# EAGLE board udayworks60 (EAGLE 9.6.2), part 1 of 2
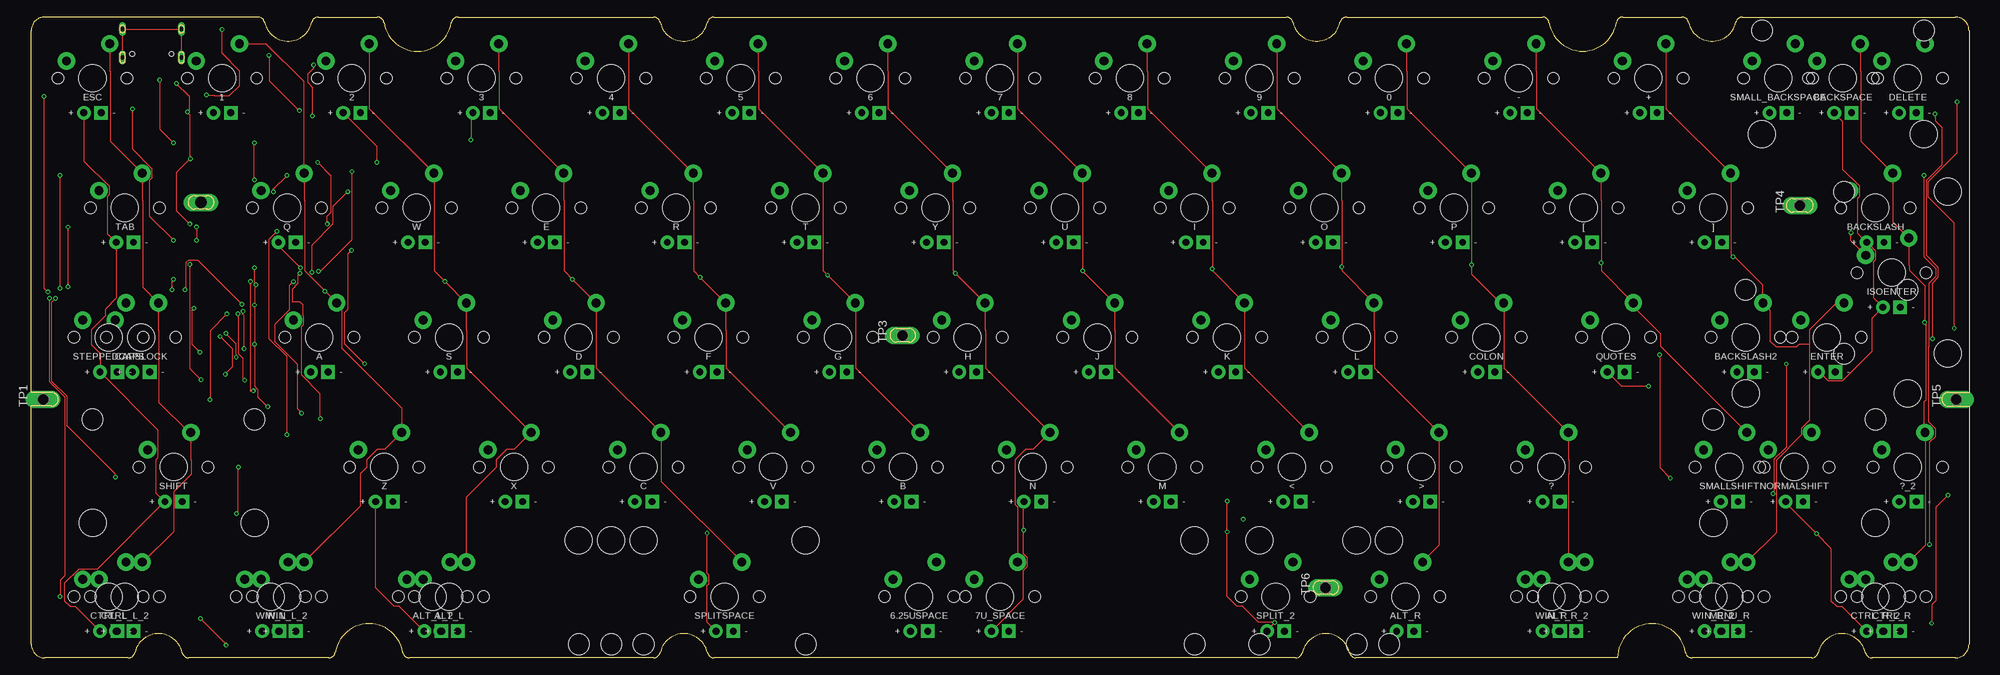
[diagram p5: board, top side]
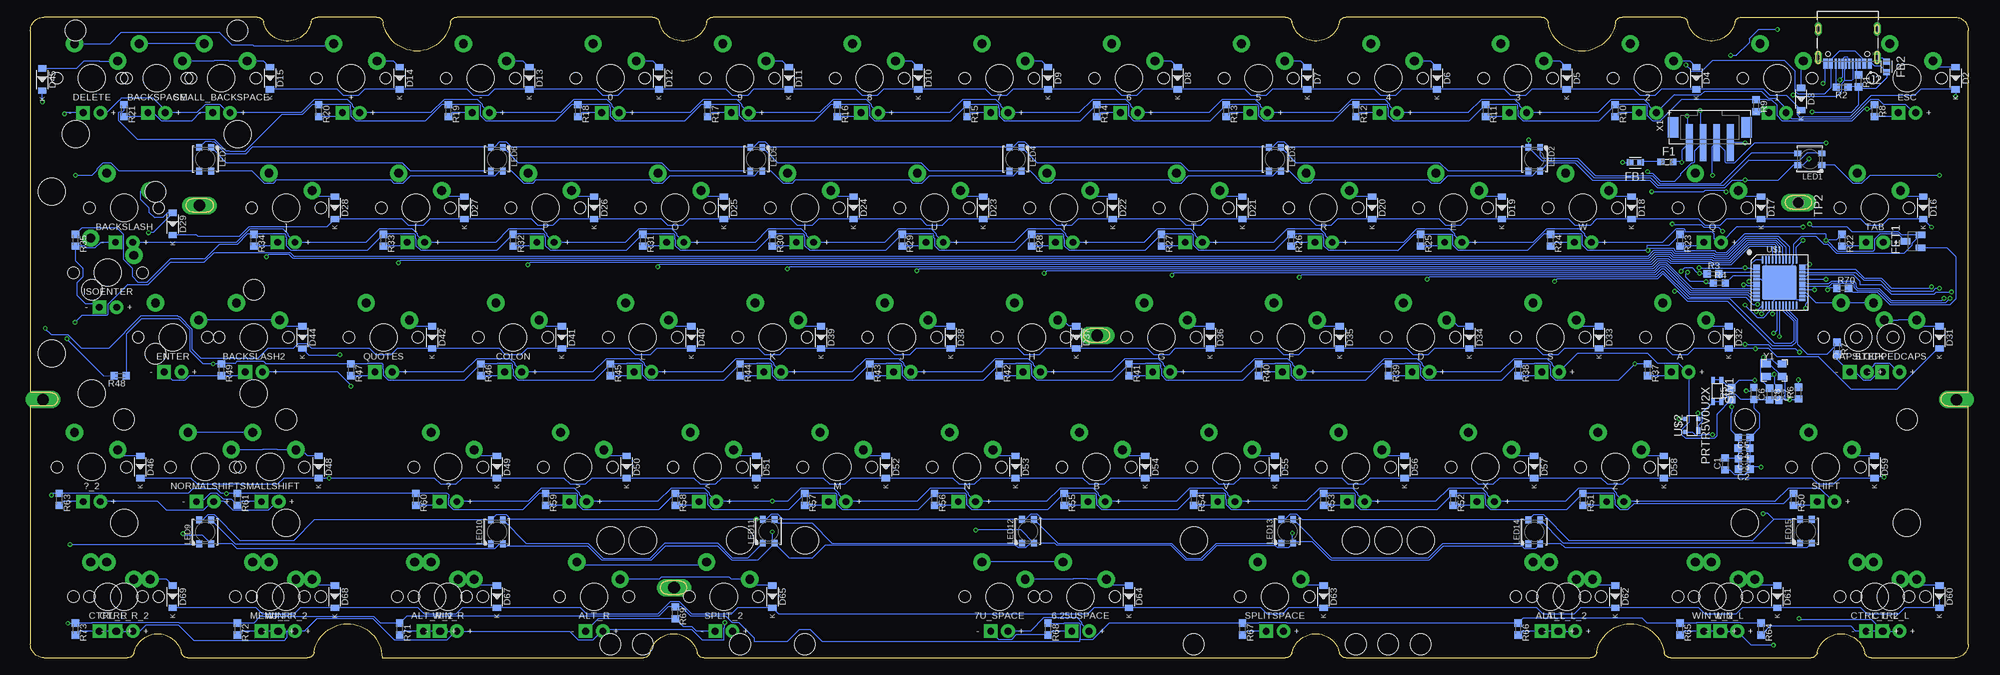
[diagram p6: board, bottom side, seen from below]

Size 284.7 x 94.2 mm. Coordinates in mm from the lower left corner, seen from the top.
Outline: 284.7,39 284.7,92.2 arc90 282.7,94.2 251.41,94.2 arc77 250.43,93.42 arc-155 243.49,93.42 arc77 242.52,94.2 233.87,94.2 arc80 232.88,93.37 arc-161 222.99,93.37 arc80 222,94.2 193.28,94.2 arc77 192.31,93.42 arc-155 185.37,93.42 arc77 184.39,94.2 100.32,94.2 arc77 99.34,93.42 arc-155 92.41,93.42 arc77 91.43,94.2 62.71,94.2 arc80 61.72,93.37 arc-161 51.83,93.37 arc80 50.84,94.2 42.2,94.2 arc77 41.22,93.42 arc-155 34.28,93.42 arc77 33.31,94.2 2,94.2 arc90 0,92.2 0,39
Outline: 0,37 0,2 arc90 2,0 14.26,0 arc77 15.23,0.78 arc-155 22.17,0.78 arc77 23.15,0 43.7,0 arc80 44.68,0.83 arc-161 54.58,0.83 arc80 55.57,0 91.43,0 arc77 92.41,0.78 arc-155 99.34,0.78 arc77 100.32,0 185.77,0 arc77 186.74,0.78 arc-155 193.68,0.78 arc77 194.66,0 233.06,0 arc-170 243.03,0.83 arc80 244.02,0 261.57,0 arc77 262.54,0.78 arc-155 269.48,0.78 arc77 270.46,0 282.7,0 arc90 284.7,2 284.7,37
Copper layers (1*16): Top 0.035mm / dielectric 1.5mm / Bottom 0.035mm
Design rules "default *": minimum track width 6mil, minimum drill 0.35mm, track to track 6mil, track to pad 6mil, pad to pad 6mil, via to via 6mil, smd to smd 6mil, copper to edge 20mil, drill to drill 6mil, minimum pad ring 6mil, minimum via ring 6mil, stop-mask expansion 4mil, vias tented up to drill 0mil, thermal gap 10mil
Milling: 22 lines

## Footprints (pad centres in the part's own frame; a part is rotated, then mirrored left to right if it is on the bottom)
MX-1U-LED = drill 1 pad 2: LED+ -1.27,-5.08 | drill 1 pad 2 square: LED- 1.27,-5.08 | drill 1.3 pad 2.54: MX1 -3.81,2.54; MX2 2.54,5.08 | hole 4: 0,0 | hole 1.7: -5.08,0; 5.08,0
MX-6.25U-LED-FLIPPED = drill 1 pad 2: LED+ -1.27,-5.08 | drill 1 pad 2 square: LED- 1.27,-5.08 | drill 1.3 pad 2.54: MX1 -3.81,2.54; MX2 2.54,5.08 | hole 4: 0,0; -50,8.24; 50,8.24 | hole 1.7: -5.08,0; 5.08,0 | hole 3.05: -50,-7; 50,-7
MX-7U-LED-FLIPPED = drill 1 pad 2: LED+ -1.27,-5.08 | drill 1 pad 2 square: LED- 1.27,-5.08 | drill 1.3 pad 2.54: MX1 -3.81,2.54; MX2 2.54,5.08 | hole 4: 0,0; -57.15,8.24; 57.15,8.24 | hole 1.7: -5.08,0; 5.08,0 | hole 3.05: -57.15,-7; 57.15,-7
MX-2U-LED = drill 1 pad 2: LED+ -1.27,-5.08 | drill 1 pad 2 square: LED- 1.27,-5.08 | drill 1.3 pad 2.54: MX1 -3.81,2.54; MX2 2.54,5.08 | hole 4: 0,0; -11.9,-8.24; 11.9,-8.24 | hole 1.7: -5.08,0; 5.08,0 | hole 3.05: -11.9,7; 11.9,7
C0603 = smd 1.05 x 1.08: 1 -0.875,0; 2 0.875,0
SOD-123 = smd 0.91 x 1.22: A -1.635,0; C 1.635,0
0603L = smd 1 x 1: 1 -0.9,0; 2 0.9,0
BEADC1608X95N = smd 0.9 x 0.97: 1 -0.785,0 | smd 0.933 x 0.97: 2 0.769,0
SOT-23-3 = smd 1 x 1.4: 1 -0.95,-1.1; 2 0.95,-1.1; 3 0,1.1
MX-2U-LED-FLIPPED-ROTATED = drill 1 pad 2: LED+ -1.27,-5.08 | drill 1 pad 2 square: LED- 1.27,-5.08 | drill 1.3 pad 2.54: MX1 -3.81,2.54; MX2 2.54,5.08 | hole 4: 0,0; 8.24,-11.9; 8.24,11.9 | hole 1.7: -5.08,0; 5.08,0 | hole 3.05: -7,-11.9; -7,11.9
HRO_TYPE-C-31-M-12 = smd 0.6 x 1.45: A1B12 -3.25,5.095; A4B9 -2.45,5.095; B1A12 3.25,5.095; B4A9 2.45,5.095 | smd 0.3 x 1.45: A5 -1.25,5.095; A6 -0.25,5.095; A7 0.25,5.095; A8 1.25,5.095; B5 1.75,5.095; B6 0.75,5.095; B7 -0.75,5.095; B8 -1.75,5.095 | drill 0.65 pad 1.05 long: S1 -4.32,4.18; S2 4.32,4.18; S3 -4.32,0; S4 4.32,0 | hole 0.7: -2.89,3.65; 2.89,3.65
LED3535 = smd 1 x 0.85: 1 -1.75,0.875; 2 -1.75,-0.875; 3 1.75,-0.875; 4 1.75,0.875
R0603 = smd 1.05 x 1.08: 1 -0.875,0; 2 0.875,0
MX-2U-LED-FLIPPED = drill 1 pad 2: LED+ -1.27,-5.08 | drill 1 pad 2 square: LED- 1.27,-5.08 | drill 1.3 pad 2.54: MX1 -3.81,2.54; MX2 2.54,5.08 | hole 4: 0,0; -11.9,8.24; 11.9,8.24 | hole 1.7: -5.08,0; 5.08,0 | hole 3.05: -11.9,-7; 11.9,-7
SWITCH-SMD-EVP-BB2A9B00 = smd 0.95 x 0.55: A@1 -1.6,0.6; A@2 -1.6,-0.6; B@3 1.6,0.6; B@4 1.6,-0.6
P1-17Y = drill 1.702 pad 2.121 long: TP 0,0
QFN-44 = smd 1 x 0.3: 1 -3.35,2.5; 2 -3.35,2; 3 -3.35,1.5; 4 -3.35,1; 5 -3.35,0.5; 6 -3.35,0; 7 -3.35,-0.5; 8 -3.35,-1; 9 -3.35,-1.5; 10 -3.35,-2; 11 -3.35,-2.5; 23 3.35,-2.5; 24 3.35,-2; 25 3.35,-1.5; 26 3.35,-1; 27 3.35,-0.5; 28 3.35,0; 29 3.35,0.5; 30 3.35,1; 31 3.35,1.5; 32 3.35,2; 33 3.35,2.5 | smd 0.3 x 1: 12 -2.5,-3.35; 13 -2,-3.35; 14 -1.5,-3.35; 15 -1,-3.35; 16 -0.5,-3.35; 17 0,-3.35; 18 0.5,-3.35; 19 1,-3.35; 20 1.5,-3.35; 21 2,-3.35; 22 2.5,-3.35; 34 2.5,3.35; 35 2,3.35; 36 1.5,3.35; 37 1,3.35; 38 0.5,3.35; 39 0,3.35; 40 -0.5,3.35; 41 -1,3.35; 42 -1.5,3.35; 43 -2,3.35; 44 -2.5,3.35 | smd 5.08 x 5.08: TAB 0,0
PRTR5V0U2X = smd 1 x 0.6: 1 -0.75,-0.95 | smd 0.6 x 0.6: 2 0.95,-0.95; 3 0.95,0.95; 4 -0.95,0.95
B4B-PH-SM4-TB = smd 1 x 5.5: 1 3,0; 2 1,0; 3 -1,0; 4 -3,0 | smd 1.6 x 3: M1 5.4,-2.25; M2 -5.4,-2.25
CRYSTAL-3.2X2.5 = smd 1.3 x 1.05: 1 -1.15,-0.925; 2 1.15,-0.925; 3 1.15,0.925; 4 -1.15,0.925

## Placement (x,y rotation side)
0  KEYSWITCH-LED-MX-1U-LED  [MX-1U-LED]  199.5,85.2 0 top
1  KEYSWITCH-LED-MX-1U-LED  [MX-1U-LED]  28.05,85.2 0 top
2  KEYSWITCH-LED-MX-1U-LED  [MX-1U-LED]  47.1,85.2 0 top
3  KEYSWITCH-LED-MX-1U-LED  [MX-1U-LED]  66.15,85.2 0 top
4  KEYSWITCH-LED-MX-1U-LED  [MX-1U-LED]  85.2,85.2 0 top
5  KEYSWITCH-LED-MX-1U-LED  [MX-1U-LED]  104.25,85.2 0 top
6  KEYSWITCH-LED-MX-1U-LED  [MX-1U-LED]  123.3,85.2 0 top
6.25USPACE  KEYSWITCH-LED-MX-6.25U-LED-FLIPPED  [MX-6.25U-LED-FLIPPED]  130.44,9 0 top
7  KEYSWITCH-LED-MX-1U-LED  [MX-1U-LED]  142.35,85.2 0 top
7U_SPACE  KEYSWITCH-LED-MX-7U-LED-FLIPPED  [MX-7U-LED-FLIPPED]  142.35,9 0 top
8  KEYSWITCH-LED-MX-1U-LED  [MX-1U-LED]  161.4,85.2 0 top
9  KEYSWITCH-LED-MX-1U-LED  [MX-1U-LED]  180.45,85.2 0 top
+  KEYSWITCH-LED-MX-1U-LED  [MX-1U-LED]  237.6,85.2 0 top
-  KEYSWITCH-LED-MX-1U-LED  [MX-1U-LED]  218.55,85.2 0 top
<  KEYSWITCH-LED-MX-1U-LED  [MX-1U-LED]  185.21,28.05 0 top
>  KEYSWITCH-LED-MX-1U-LED  [MX-1U-LED]  204.26,28.05 0 top
?  KEYSWITCH-LED-MX-1U-LED  [MX-1U-LED]  223.31,28.05 0 top
?_2  KEYSWITCH-LED-MX-1U-LED  [MX-1U-LED]  275.7,28.05 0 top
[  KEYSWITCH-LED-MX-1U-LED  [MX-1U-LED]  228.07,66.15 0 top
]  KEYSWITCH-LED-MX-1U-LED  [MX-1U-LED]  247.12,66.15 0 top
A  KEYSWITCH-LED-MX-1U-LED  [MX-1U-LED]  42.34,47.1 0 top
ALT_L  KEYSWITCH-LED-MX-1U-LED  [MX-1U-LED]  61.39,9 0 top
ALT_L_2  KEYSWITCH-LED-MX-1U-LED  [MX-1U-LED]  59.01,9 0 top
ALT_R  KEYSWITCH-LED-MX-1U-LED  [MX-1U-LED]  201.88,9 0 top
ALT_R_2  KEYSWITCH-LED-MX-1U-LED  [MX-1U-LED]  225.69,9 0 top
B  KEYSWITCH-LED-MX-1U-LED  [MX-1U-LED]  128.06,28.05 0 top
BACKSLASH  KEYSWITCH-LED-MX-1U-LED  [MX-1U-LED]  270.94,66.15 0 top
BACKSLASH2  KEYSWITCH-LED-MX-1U-LED  [MX-1U-LED]  251.89,47.1 0 top
BACKSPACE  KEYSWITCH-LED-MX-2U-LED  [MX-2U-LED]  266.18,85.2 0 top
C  KEYSWITCH-LED-MX-1U-LED  [MX-1U-LED]  89.96,28.05 0 top
C1  0.1uF  [C0603]  35.71,28.5 90 bottom
C2  0.1uF  [C0603]  32.91,27.73 180 bottom
C3  0.1uF  [C0603]  32.9,29.25 180 bottom
C4  0.1uF  [C0603]  32.95,30.82 180 bottom
C5  0.1uF  [C0603]  32.93,32.41 180 bottom
C6  1uF  [C0603]  31.5,38.86 270 bottom
C7  22pF  [C0603]  27.84,38.75 270 bottom
C8  22pF  [C0603]  29.21,38.76 270 bottom
CAPSLOCK  KEYSWITCH-LED-MX-1U-LED  [MX-1U-LED]  16.14,47.1 0 top
COLON  KEYSWITCH-LED-MX-1U-LED  [MX-1U-LED]  213.79,47.1 0 top
CTRL_L  KEYSWITCH-LED-MX-1U-LED  [MX-1U-LED]  11.38,9 0 top
CTRL_L_2  KEYSWITCH-LED-MX-1U-LED  [MX-1U-LED]  13.76,9 0 top
CTRL_R  KEYSWITCH-LED-MX-1U-LED  [MX-1U-LED]  273.32,9 0 top
CTRL_R_2  KEYSWITCH-LED-MX-1U-LED  [MX-1U-LED]  270.94,9 0 top
D  KEYSWITCH-LED-MX-1U-LED  [MX-1U-LED]  80.44,47.1 0 top
D2  [SOD-123]  1.86,85.2 270 bottom
D3  [SOD-123]  24.56,82.14 270 bottom
D4  [SOD-123]  39.96,85.2 270 bottom
D5  [SOD-123]  59.01,85.2 270 bottom
D6  [SOD-123]  78.06,85.2 270 bottom
D7  [SOD-123]  97.11,85.2 270 bottom
D8  [SOD-123]  116.16,85.2 270 bottom
D9  [SOD-123]  135.21,85.2 270 bottom
D10  [SOD-123]  154.26,85.2 270 bottom
D11  [SOD-123]  173.31,85.2 270 bottom
D12  [SOD-123]  192.36,85.2 270 bottom
D13  [SOD-123]  211.41,85.2 270 bottom
D14  [SOD-123]  230.46,85.2 270 bottom
D15  [SOD-123]  249.51,85.2 270 bottom
D16  [SOD-123]  6.62,66.15 270 bottom
D17  [SOD-123]  30.43,66.15 270 bottom
D18  [SOD-123]  49.48,66.15 270 bottom
D19  [SOD-123]  68.53,66.15 270 bottom
D20  [SOD-123]  87.58,66.15 270 bottom
D21  [SOD-123]  106.63,66.15 270 bottom
D22  [SOD-123]  125.68,66.15 270 bottom
D23  [SOD-123]  144.73,66.15 270 bottom
D24  [SOD-123]  163.78,66.15 270 bottom
D25  [SOD-123]  182.83,66.15 270 bottom
D26  [SOD-123]  201.88,66.15 270 bottom
D27  [SOD-123]  220.93,66.15 270 bottom
D28  [SOD-123]  239.98,66.15 270 bottom
D29  [SOD-123]  263.79,63.77 270 bottom
D31  [SOD-123]  4.24,47.1 270 bottom
D32  [SOD-123]  35.19,47.1 270 bottom
D33  [SOD-123]  54.24,47.1 270 bottom
D34  [SOD-123]  73.29,47.1 270 bottom
D35  [SOD-123]  92.34,47.1 270 bottom
D36  [SOD-123]  111.39,47.1 270 bottom
D37  [SOD-123]  131.06,47.11 270 bottom
D38  [SOD-123]  149.49,47.1 270 bottom
D39  [SOD-123]  168.54,47.1 270 bottom
D40  [SOD-123]  187.59,47.1 270 bottom
D41  [SOD-123]  206.64,47.1 270 bottom
D42  [SOD-123]  225.69,47.1 270 bottom
D44  [SOD-123]  244.74,47.1 270 bottom
D45  [SOD-123]  282.97,85.01 270 bottom
D46  [SOD-123]  268.56,28.05 270 bottom
D48  [SOD-123]  242.36,28.05 270 bottom
D49  [SOD-123]  216.17,28.05 270 bottom
D50  [SOD-123]  197.12,28.05 270 bottom
D51  [SOD-123]  178.07,28.05 270 bottom
D52  [SOD-123]  159.02,28.05 270 bottom
D53  [SOD-123]  139.97,28.05 270 bottom
D54  [SOD-123]  120.92,28.05 270 bottom
D55  [SOD-123]  101.87,28.05 270 bottom
D56  [SOD-123]  82.82,28.05 270 bottom
D57  [SOD-123]  63.77,28.05 270 bottom
D58  [SOD-123]  44.72,28.05 270 bottom
D59  [SOD-123]  13.76,28.05 270 bottom
D60  [SOD-123]  4.24,9 270 bottom
D61  [SOD-123]  28.05,9 270 bottom
D62  [SOD-123]  51.86,9 270 bottom
D63  [SOD-123]  94.73,9 270 bottom
D64  [SOD-123]  123.3,9 270 bottom
D65  [SOD-123]  175.69,9 270 bottom
D67  [SOD-123]  216.17,9 270 bottom
D68  [SOD-123]  239.98,9 270 bottom
D69  [SOD-123]  263.79,9 270 bottom
DELETE  KEYSWITCH-LED-MX-1U-LED  [MX-1U-LED]  275.7,85.2 0 top
E  KEYSWITCH-LED-MX-1U-LED  [MX-1U-LED]  75.67,66.15 0 top
ENTER  KEYSWITCH-LED-MX-2U-LED  [MX-2U-LED]  263.79,47.1 0 top
ESC  KEYSWITCH-LED-MX-1U-LED  [MX-1U-LED]  9,85.2 0 top
F  KEYSWITCH-LED-MX-1U-LED  [MX-1U-LED]  99.49,47.1 0 top
F1  0603L050  [0603L]  44.26,72.91 0 bottom
FB1  FERRITE_BEAD  [BEADC1608X95N]  48.93,72.82 180 bottom
FB2  FERRITE_BEAD  [BEADC1608X95N]  12,86.87 270 bottom
FET1  [SOT-23-3]  8.13,61.22 90 bottom
G  KEYSWITCH-LED-MX-1U-LED  [MX-1U-LED]  118.54,47.1 0 top
H  KEYSWITCH-LED-MX-1U-LED  [MX-1U-LED]  137.59,47.1 0 top
I  KEYSWITCH-LED-MX-1U-LED  [MX-1U-LED]  170.92,66.15 0 top
ISOENTER  KEYSWITCH-LED-MX-2U-LED-FLIPPED-ROTATED  [MX-2U-LED-FLIPPED-ROTATED]  273.32,56.63 0 top
J  KEYSWITCH-LED-MX-1U-LED  [MX-1U-LED]  156.64,47.1 0 top
J2  TYPE-C-31-M-12  [HRO_TYPE-C-31-M-12]  17.72,92.43 180 bottom
K  KEYSWITCH-LED-MX-1U-LED  [MX-1U-LED]  175.69,47.1 0 top
L  KEYSWITCH-LED-MX-1U-LED  [MX-1U-LED]  194.74,47.1 0 top
LED1  WS2812B3535  [LED3535]  23.29,73.29 180 bottom
LED2  WS2812B3535  [LED3535]  63.77,73.29 270 bottom
LED3  WS2812B3535  [LED3535]  101.87,73.29 270 bottom
LED4  WS2812B3535  [LED3535]  139.97,73.29 270 bottom
LED5  WS2812B3535  [LED3535]  178.07,73.29 270 bottom
LED6  WS2812B3535  [LED3535]  216.17,73.29 270 bottom
LED7  WS2812B3535  [LED3535]  259.03,73.29 270 bottom
LED9  WS2812B3535  [LED3535]  259.03,18.53 90 bottom
LED10  WS2812B3535  [LED3535]  216.17,18.53 90 bottom
LED11  WS2812B3535  [LED3535]  176.24,18.61 90 bottom
LED12  WS2812B3535  [LED3535]  138.14,18.61 90 bottom
LED13  WS2812B3535  [LED3535]  100.04,18.61 90 bottom
LED14  WS2812B3535  [LED3535]  63.77,18.53 90 bottom
LED15  WS2812B3535  [LED3535]  23.84,18.61 90 bottom
M  KEYSWITCH-LED-MX-1U-LED  [MX-1U-LED]  166.16,28.05 0 top
MENU_R  KEYSWITCH-LED-MX-1U-LED  [MX-1U-LED]  249.51,9 0 top
N  KEYSWITCH-LED-MX-1U-LED  [MX-1U-LED]  147.11,28.05 0 top
NORMALSHIFT  KEYSWITCH-LED-MX-2U-LED  [MX-2U-LED]  259.03,28.05 0 top
O  KEYSWITCH-LED-MX-1U-LED  [MX-1U-LED]  189.97,66.15 0 top
P  KEYSWITCH-LED-MX-1U-LED  [MX-1U-LED]  209.02,66.15 0 top
Q  KEYSWITCH-LED-MX-1U-LED  [MX-1U-LED]  37.58,66.15 0 top
QUOTES  KEYSWITCH-LED-MX-1U-LED  [MX-1U-LED]  232.84,47.1 0 top
R  KEYSWITCH-LED-MX-1U-LED  [MX-1U-LED]  94.73,66.15 0 top
R1  5.1k  [R0603]  16.13,84.8 270 bottom
R2  5.1k  [R0603]  18.54,83.87 180 bottom
R3  22  [R0603]  37.51,56.47 0 bottom
R4  22  [R0603]  36.56,55.1 0 bottom
R5  10K  [R0603]  34.78,38.83 90 bottom
R6  10K  [R0603]  24.96,38.91 90 bottom
R7  1K  [R0603]  19.3,45.51 270 bottom
R8  1K  [R0603]  13.76,80.44 270 bottom
R9  1K  [R0603]  31.18,81.15 270 bottom
R10  1K  [R0603]  51.86,80.44 270 bottom
R11  1K  [R0603]  70.91,80.44 270 bottom
R12  1K  [R0603]  89.96,80.44 270 bottom
R13  1K  [R0603]  109.01,80.44 270 bottom
R14  1K  [R0603]  128.06,80.44 270 bottom
R15  1K  [R0603]  147.11,80.44 270 bottom
R16  1K  [R0603]  166.16,80.44 270 bottom
R17  1K  [R0603]  185.21,80.44 270 bottom
R18  1K  [R0603]  204.26,80.44 270 bottom
R19  1K  [R0603]  223.31,80.44 270 bottom
R20  1K  [R0603]  242.36,80.44 270 bottom
R21  1K  [R0603]  270.94,80.44 270 bottom
R22  1K  [R0603]  18.52,61.39 270 bottom
R23  1K  [R0603]  42.34,61.39 270 bottom
R24  1K  [R0603]  61.39,61.39 270 bottom
R25  1K  [R0603]  80.44,61.39 270 bottom
R26  1K  [R0603]  99.49,61.39 270 bottom
R27  1K  [R0603]  118.54,61.39 270 bottom
R28  1K  [R0603]  137.59,61.39 270 bottom
R29  1K  [R0603]  156.64,61.39 270 bottom
R30  1K  [R0603]  175.69,61.39 270 bottom
R31  1K  [R0603]  194.74,61.39 270 bottom
R32  1K  [R0603]  213.79,61.39 270 bottom
R33  1K  [R0603]  232.84,61.39 270 bottom
R34  1K  [R0603]  251.89,61.39 270 bottom
R35  1K  [R0603]  278.08,61.39 270 bottom
R37  1K  [R0603]  47.1,42.34 270 bottom
R38  1K  [R0603]  66.15,42.34 270 bottom
R39  1K  [R0603]  85.2,42.34 270 bottom
R40  1K  [R0603]  104.25,42.34 270 bottom
R41  1K  [R0603]  123.3,42.34 270 bottom
R42  1K  [R0603]  142.35,42.34 270 bottom
R43  1K  [R0603]  161.4,42.34 270 bottom
R44  1K  [R0603]  180.45,42.34 270 bottom
R45  1K  [R0603]  199.5,42.34 270 bottom
R46  1K  [R0603]  218.55,42.34 270 bottom
R47  1K  [R0603]  237.6,42.34 270 bottom
R48  1K  [R0603]  271.52,41.49 180 bottom
R49  1K  [R0603]  256.65,42.34 270 bottom
R50  1K  [R0603]  25.67,23.29 270 bottom
R51  1K  [R0603]  56.62,23.29 270 bottom
R52  1K  [R0603]  75.67,23.29 270 bottom
R53  1K  [R0603]  94.73,23.29 270 bottom
R54  1K  [R0603]  113.78,23.29 270 bottom
R55  1K  [R0603]  132.82,23.29 270 bottom
R56  1K  [R0603]  151.88,23.29 270 bottom
R57  1K  [R0603]  170.92,23.29 270 bottom
R58  1K  [R0603]  189.97,23.29 270 bottom
R59  1K  [R0603]  209.02,23.29 270 bottom
R60  1K  [R0603]  228.07,23.29 270 bottom
R61  1K  [R0603]  254.27,23.29 270 bottom
R63  1K  [R0603]  280.46,23.29 270 bottom
R64  1K  [R0603]  30.43,4.24 270 bottom
R65  1K  [R0603]  42.34,4.24 270 bottom
R66  1K  [R0603]  66.15,4.24 270 bottom
R67  1K  [R0603]  106.63,4.24 270 bottom
R68  1K  [R0603]  135.21,4.24 270 bottom
R69  1K  [R0603]  189.97,6.62 270 bottom
R70  1K  [R0603]  18.46,54.34 0 bottom
R71  1K  [R0603]  230.46,4.24 270 bottom
R72  1K  [R0603]  254.27,4.24 270 bottom
R73  1K  [R0603]  278.08,4.24 270 bottom
S  KEYSWITCH-LED-MX-1U-LED  [MX-1U-LED]  61.39,47.1 0 top
SHIFT  KEYSWITCH-LED-MX-2U-LED  [MX-2U-LED]  20.91,28.05 0 top
SMALL_BACKSPACE  KEYSWITCH-LED-MX-1U-LED  [MX-1U-LED]  256.65,85.2 0 top
SMALLSHIFT  KEYSWITCH-LED-MX-1U-LED  [MX-1U-LED]  249.51,28.05 0 top
SPLIT_2  KEYSWITCH-LED-MX-2U-LED-FLIPPED  [MX-2U-LED-FLIPPED]  182.83,9 0 top
SPLITSPACE  KEYSWITCH-LED-MX-2U-LED-FLIPPED  [MX-2U-LED-FLIPPED]  101.87,9 0 top
STEPPEDCAPS  KEYSWITCH-LED-MX-1U-LED  [MX-1U-LED]  11.38,47.1 0 top
SW1  SWITCH-SMD-EVP-BB2A9B00  [SWITCH-SMD-EVP-BB2A9B00]  36.88,39.24 90 bottom
T  KEYSWITCH-LED-MX-1U-LED  [MX-1U-LED]  113.78,66.15 0 top
TAB  KEYSWITCH-LED-MX-1U-LED  [MX-1U-LED]  13.76,66.15 0 top
TP1  TPPAD1-17Y  [P1-17Y]  1.74,37.98 90 top
TP2  TPPAD1-17Y  [P1-17Y]  24.96,66.94 270 bottom
TP3  TPPAD1-17Y  [P1-17Y]  127.99,47.39 90 top
TP4  TPPAD1-17Y  [P1-17Y]  259.85,66.51 90 top
TP5  TPPAD1-17Y  [P1-17Y]  282.85,37.97 90 top
TP6  TPPAD1-17Y  [P1-17Y]  190.14,10.31 90 top
U  KEYSWITCH-LED-MX-1U-LED  [MX-1U-LED]  151.88,66.15 0 top
U$1  ATMEGA32U4-QFN44  [QFN-44]  27.74,55.16 0 bottom
U$2  PRTR5V0U2X  [PRTR5V0U2X]  40.6,34.15 90 bottom
V  KEYSWITCH-LED-MX-1U-LED  [MX-1U-LED]  109.01,28.05 0 top
W  KEYSWITCH-LED-MX-1U-LED  [MX-1U-LED]  56.62,66.15 0 top
WIN_L  KEYSWITCH-LED-MX-1U-LED  [MX-1U-LED]  35.19,9 0 top
WIN_L_2  KEYSWITCH-LED-MX-1U-LED  [MX-1U-LED]  37.58,9 0 top
WIN_R  KEYSWITCH-LED-MX-1U-LED  [MX-1U-LED]  223.31,9 0 top
WIN_R_2  KEYSWITCH-LED-MX-1U-LED  [MX-1U-LED]  247.12,9 0 top
X  KEYSWITCH-LED-MX-1U-LED  [MX-1U-LED]  70.91,28.05 0 top
X1  B4B-PH-SM4-TB  [B4B-PH-SM4-TB]  37.97,75.74 180 bottom
Y  KEYSWITCH-LED-MX-1U-LED  [MX-1U-LED]  132.82,66.15 0 top
Y1  16MHz  [CRYSTAL-3.2X2.5]  28.5,42.28 0 bottom
Z  KEYSWITCH-LED-MX-1U-LED  [MX-1U-LED]  51.86,28.05 0 top